# Altium schematic sheet Medusa-AI-ESP.SchDoc
size Legal; SheetNumber: 1; SheetTotal: 5
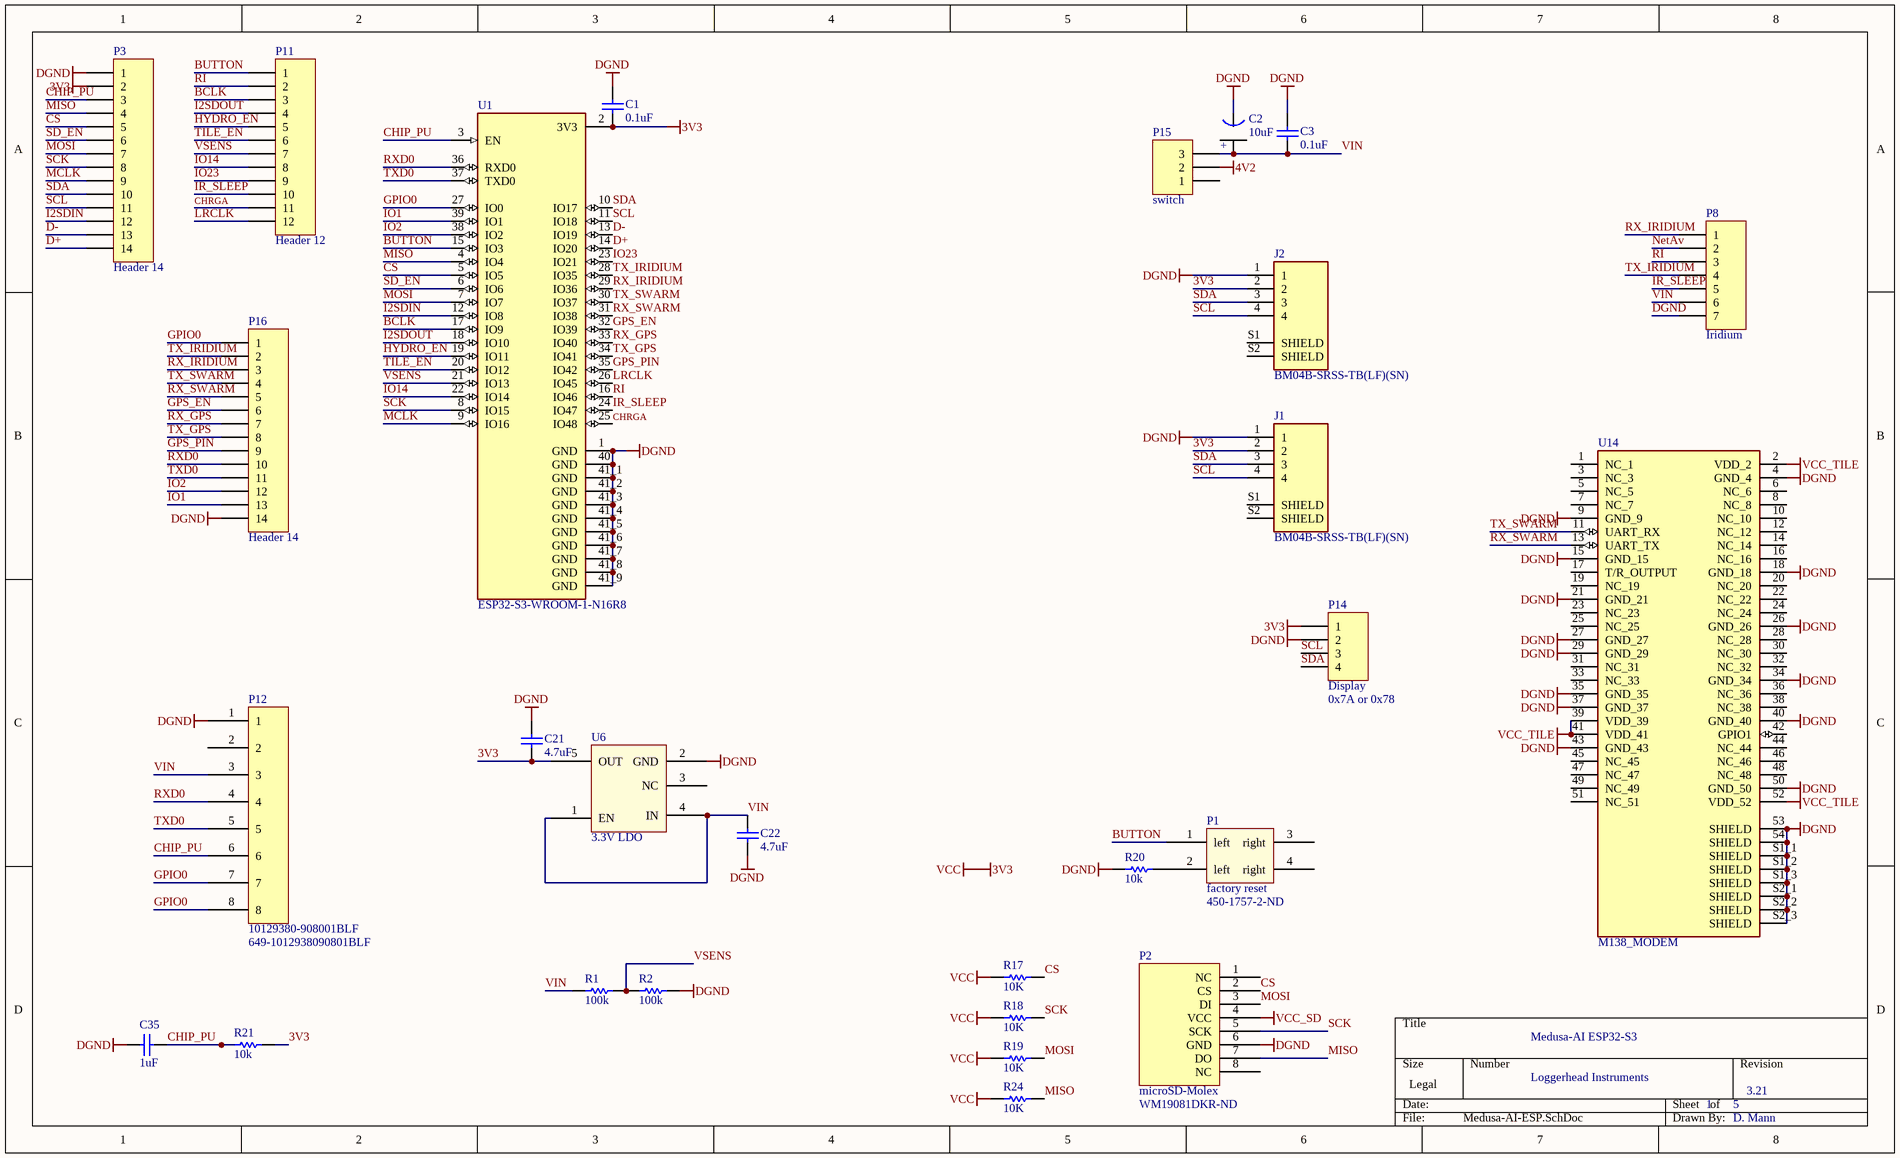
[diagram p0: Medusa-AI-ESP.SchDoc]

## Parts
C1  0.1uF  [0402]
C2  10uF  [Tant0805]
C3  0.1uF  [0402]
C21  4.7uF  [0402]
C22  4.7uF  [0402]
C35  1uF  [0402]
J1  BM04B-SRSS-TB(LF)(SN)  [CONN_BM04B-SRSS-TB(LF)(SN)]
J2  BM04B-SRSS-TB(LF)(SN)  [CONN_BM04B-SRSS-TB(LF)(SN)]
P1  factory reset  Supplier Part Number 1: 450-1757-2-ND  [SOP4]
P2  microSD-Molex  Supplier Part Number 1: WM19081DKR-ND  [microSD_Molex_hinged]
P3  Header 14  [HDR1X14]
P8  Iridium  [HDR1X7]
P11  Header 12  [HDR1X12]
P12  10129380-908001BLF  Supplier Part Number 1: 649-1012938090801BLF  [Header_8_SMT]
P14  Display  [HDR1X4]
P15  switch  [HDR1X3]
P16  Header 14  [HDR1X14]
R1  100k  [3-0603]
R2  100k  [3-0603]
R17  10K  [3-0603]
R18  10K  [3-0603]
R19  10K  [3-0603]
R20  10k  [2-0402]
R21  10k  [2-0402]
R24  10K  [3-0603]
U1  ESP32-S3-WROOM-1-N16R8  [XCVR_ESP32-S3-WROOM-1-N16R2]
U6  3.3V LDO  [AP7361C-33Y5-13]
U14  M138_MODEM  [XCVR_M138_MODEM]

## Nets
3V3: C1.1 C21.2 J1.2 J2.2 P3.2 P14.1 R17.1 R18.1 R19.1 R21.1 R24.1 U1.2(3V3) U6.5(OUT)  [also labelled VCC]
4V2: P15.2
DGND: C1.2 C2.1(GND) C3.2 C21.1 C22.2 C35.2 J1.1 J2.1 P2.6(GND) P3.1 P8.7 P12.1 P14.2 P16.14 R2.1 R20.2 U1.1(GND) U1.40(GND) U1.41_1(GND) U1.41_2(GND) U1.41_3(GND) U1.41_4(GND) U1.41_5(GND) U1.41_6(GND) U1.41_7(GND) U1.41_8(GND) U1.41_9(GND) U6.2(GND) U14.4(GND_4) U14.9(GND_9) U14.15(GND_15) U14.18(GND_18) U14.21(GND_21) U14.26(GND_26) U14.27(GND_27) U14.29(GND_29) U14.34(GND_34) U14.35(GND_35) U14.37(GND_37) U14.40(GND_40) U14.43(GND_43) U14.50(GND_50) U14.53(SHIELD) U14.54(SHIELD) U14.S1_1(SHIELD) U14.S1_2(SHIELD) U14.S1_3(SHIELD) U14.S2_1(SHIELD) U14.S2_2(SHIELD) U14.S2_3(SHIELD)
VCC_SD: P2.4(VCC)
VCC_TILE: U14.2(VDD_2) U14.39(VDD_39) U14.41(VDD_41) U14.52(VDD_52)
BCLK: P11.3 U1.17(IO9)
BUTTON: P1.1(left) P11.1 U1.15(IO3)
CHIP_PU: C35.1 P3.3 P12.6 R21.2 U1.3(EN)
CHRGA: P11.11 U1.25(IO48)
CS: P2.2(CS) P3.5 R17.2 U1.5(IO5)
D+: P3.14 U1.14(IO20)
D-: P3.13 U1.13(IO19)
GPIO0: P12.7 P12.8 P16.1 U1.27(IO0)
GPS_EN: P16.6 U1.32(IO39)
GPS_PIN: P16.9 U1.35(IO42)
HYDRO_EN: P11.5 U1.19(IO11)
I2SDIN: P3.12 U1.12(IO8)
I2SDOUT: P11.4 U1.18(IO10)
IO1: P16.13 U1.39(IO1)
IO2: P16.12 U1.38(IO2)
IO14: P11.8 U1.22(IO14)
IO23: P11.9 U1.23(IO21)
IR_SLEEP: P8.5 P11.10 U1.24(IO47)
LRCLK: P11.12 U1.26(IO45)
MCLK: P3.9 U1.9(IO16)
MISO: P2.7(DO) P3.4 R24.2 U1.4(IO4)
MOSI: P2.3(DI) P3.7 R19.2 U1.7(IO7)
NetAv: P8.2
RI: P8.3 P11.2 U1.16(IO46)
RX_GPS: P16.7 U1.33(IO40)
RX_IRIDIUM: P8.1 P16.3 U1.29(IO36)
RX_SWARM: P16.5 U1.31(IO38) U14.13(UART_TX)
RXD0: P12.4 P16.10 U1.36(RXD0)
SCK: P2.5(SCK) P3.8 R18.2 U1.8(IO15)
SCL: J1.4 J2.4 P3.11 P14.3 U1.11(IO18)
SD_EN: P3.6 U1.6(IO6)
SDA: J1.3 J2.3 P3.10 P14.4 U1.10(IO17)
TILE_EN: P11.6 U1.20(IO12)
TX_GPS: P16.8 U1.34(IO41)
TX_IRIDIUM: P8.4 P16.2 U1.28(IO35)
TX_SWARM: P16.4 U1.30(IO37) U14.11(UART_RX)
TXD0: P12.5 P16.11 U1.37(TXD0)
VIN: C2.2(+) C3.1 C22.1 P8.6 P12.3 P15.3 R1.2 U6.1(EN) U6.4(IN)
VSENS: P11.7 R1.1 R2.2 U1.21(IO13)
NetP1_2: P1.2(left) R20.1

Not connected (* = marked no-connect by the designer): J1 S1(SHIELD) S2(SHIELD); J2 S1(SHIELD) S2(SHIELD); P1 3(right) 4(right); P2 1(NC) 8(NC); P12 2; P15 1; U6 3(NC); U14 1(NC_1) 3(NC_3) 5(NC_5) 6(NC_6) 7(NC_7) 8(NC_8) 10(NC_10) 12(NC_12) 14(NC_14) 16(NC_16) 17(T/R_OUTPUT) 19(NC_19) 20(NC_20) 22(NC_22) 23(NC_23) 24(NC_24) 25(NC_25) 28(NC_28) 30(NC_30) 31(NC_31) 32(NC_32) 33(NC_33) 36(NC_36) 38(NC_38) 42(GPIO1) 44(NC_44) 45(NC_45) 46(NC_46) 47(NC_47) 48(NC_48) 49(NC_49) 51(NC_51)

## Notes on the sheet
- (near P14) 0x7A or 0x78
- Medusa-AI ESP32-S3
- Loggerhead Instruments
- 1
- 5
- 3.21
- D. Mann

## Library data of the parts
C1 C3 = C0402: Ceramic Chip Capacitor - Standard; Note: Footprint corresponds to dimensions for bulk cassette packaging. This case size has tightened tolerances.; Published: 17-Jul-2002; LatestRevisionDate: 19-Mar-2004; LatestRevisionNote: Silkscreen size reduced.; DatasheetDocument: Mar-2001; PackageDocument: Mar-2001; PackageReference: 0402; Publisher: Altium Limited; Code_JEITA: 0402; Code_IPC: 1005 [0402]; ComponentLink1Description: Manufacturer Link; ComponentLink1URL: http://www.kemet.com/; ComponentLink2Description: Datasheet; ComponentLink2URL: http://www.kemet.com/kemet/web/homepage/kechome.nsf/vapubfilesname/F3102TA.pdf/$file/F3102TA.pdf; Value: 0.1uF
C2 = Tant0805: Value: 10uF
C21 C22 C35 = C0402: Ceramic Chip Capacitor - Standard; Note: Footprint corresponds to dimensions for bulk cassette packaging. This case size has tightened tolerances.; Value: 0.1uF; Published: 17-Jul-2002; LatestRevisionDate: 19-Mar-2004; LatestRevisionNote: Silkscreen size reduced.; DatasheetDocument: Mar-2001; PackageDocument: Mar-2001; PackageReference: 0402; Publisher: Altium Limited; Code_JEITA: 0402; Code_IPC: 1005 [0402]; ComponentLink1Description: Manufacturer Link; ComponentLink1URL: http://www.kemet.com/; ComponentLink2Description: Datasheet; ComponentLink2URL: http://www.kemet.com/kemet/web/homepage/kechome.nsf/vapubfilesname/F3102TA.pdf/$file/F3102TA.pdf
J1 J2 = BM04B-SRSS-TB(LF)(SN): Connector Header Surface Mount 4 position 0.039 _1.00mm_; MF: JST Sales; MP: BM04B-SRSS-TB_LF__SN_; Price: None; Availability: Unavailable; Package: None; SnapEDA_Link: https://www.snapeda.com/parts/BM04B-SRSS-TB%28LF%29%28SN%29/JST%20Sales%20America%20Inc./view-part/91778/?ref=snap; Value: *
P1 = pushbutton: Supplier 1: Digi-Key
P2 = microSD_Molex_hinged: Supplier 1: Digi-Key
P3 P16 = Header 14: Header, 14-Pin; LatestRevisionDate: 17-Jul-2002; LatestRevisionNote: Re-released for DXP Platform.; Publisher: Altium Limited
P8 = Header 7: Header, 7-Pin; LatestRevisionDate: 17-Jul-2002; LatestRevisionNote: Re-released for DXP Platform.; Publisher: Altium Limited
P11 = Header 12: Header, 12-Pin; LatestRevisionDate: 17-Jul-2002; LatestRevisionNote: Re-released for DXP Platform.; Publisher: Altium Limited
P12 = Header8_SMT: Surface mount header; Supplier 1: Mouser
P14 = Header 4: Header, 4-Pin; LatestRevisionDate: 17-Jul-2002; LatestRevisionNote: Re-released for DXP Platform.; Publisher: Altium Limited
P15 = Header 3: Header, 3-Pin; LatestRevisionDate: 17-Jul-2002; LatestRevisionNote: Re-released for DXP Platform.; Publisher: Altium Limited
R1 R2 = ERJ3RK: Precision Thick Film Chip Resistor, 10 Ohm to 1M Ohm Range, 1% and 0.5% Tolerance, 0603 Size, 0.063 W; Published: 17-Dec-2003; LatestRevisionDate: 19-Mar-2004; LatestRevisionNote: Silkscreen size reduced.; PackageDocument: Mar-2003; PackageReference: 3-0603; Publisher: Altium Limited; Code_IPC: 1608 [0603]; ComponentLink1Description: Manufacturer Link; ComponentLink1URL: http://www.panasonic.com/industrial/components/resistive_products.htm; ComponentLink2Description: Datasheet; ComponentLink2URL: http://www.panasonic.com/industrial/components/pdf/AOA0000CE2.pdf
R17-R19 R24 = ERJ3EK: Precision Thick Film Chip Resistor, 10 Ohm to 1M Ohm Range, 1% and 0.5% Tolerance, 0603 Size, 0.063 W; Published: 17-Dec-2003; LatestRevisionDate: 19-Mar-2004; LatestRevisionNote: Silkscreen size reduced.; PackageDocument: Mar-2003; PackageReference: 3-0603; Publisher: Altium Limited; Code_IPC: 1608 [0603]; ComponentLink1Description: Manufacturer Link; ComponentLink1URL: http://www.panasonic.com/industrial/components/resistive_products.htm; ComponentLink2Description: Datasheet; ComponentLink2URL: http://www.panasonic.com/industrial/components/pdf/AOA0000CE2.pdf
R20 R21 = ERJ2RB: Precision Thick Film Chip Resistor, 10 Ohm to 1M Ohm Range, 1% and 0.5% Tolerance, 0402 Size, 0.063 W; Published: 17-Dec-2003; LatestRevisionDate: 19-Mar-2004; LatestRevisionNote: Silkscreen size reduced.; PackageDocument: Mar-2003; PackageReference: 2-0402; Publisher: Altium Limited; Code_IPC: 1005 [0402]; ComponentLink1Description: Manufacturer Link; ComponentLink1URL: http://www.panasonic.com/industrial/components/resistive_products.htm; ComponentLink2Description: Datasheet; ComponentLink2URL: http://www.panasonic.com/industrial/components/pdf/AOA0000CE2.pdf
U1 = ESP32-S3-WROOM-1-N16R2: Bluetooth, WiFi 802.11b/g/n, Bluetooth v5.0 Transceiver Module 2.4GHz PCB Trace Surface Mount; MF: Espressif Systems; Package: None; Availability: In Stock; SnapEDA_Link: https://www.snapeda.com/parts/ESP32-S3-WROOM-1-N16R2/Espressif+Systems/view-part/?ref=snap; MP: ESP32-S3-WROOM-1-N16R2; Value: *; Purchase-URL: https://pricing.snapeda.com/search/part/ESP32-S3-WROOM-1-N16R2/?ref=eda; Price: None; Check_prices: https://www.snapeda.com/parts/ESP32-S3-WROOM-1-N16R2/Espressif+Systems/view-part/?ref=eda
U6 = AP7361C-33Y5-13
U14 = M138_MODEM: Swarm M138 Modem; MF: Swarm; Check_prices: https://www.snapeda.com/parts/M138%20Modem/Swarm/view-part/?ref=eda; Value: *; Package: Package; Price: None; Availability: Not in stock; MP: M138 Modem; SnapEDA_Link: https://www.snapeda.com/parts/M138%20Modem/Swarm/view-part/?ref=snap